# Altium schematic sheet AC_DC_CONTROL.SchDoc
size A4; SheetNumber: 2; SheetTotal: 2
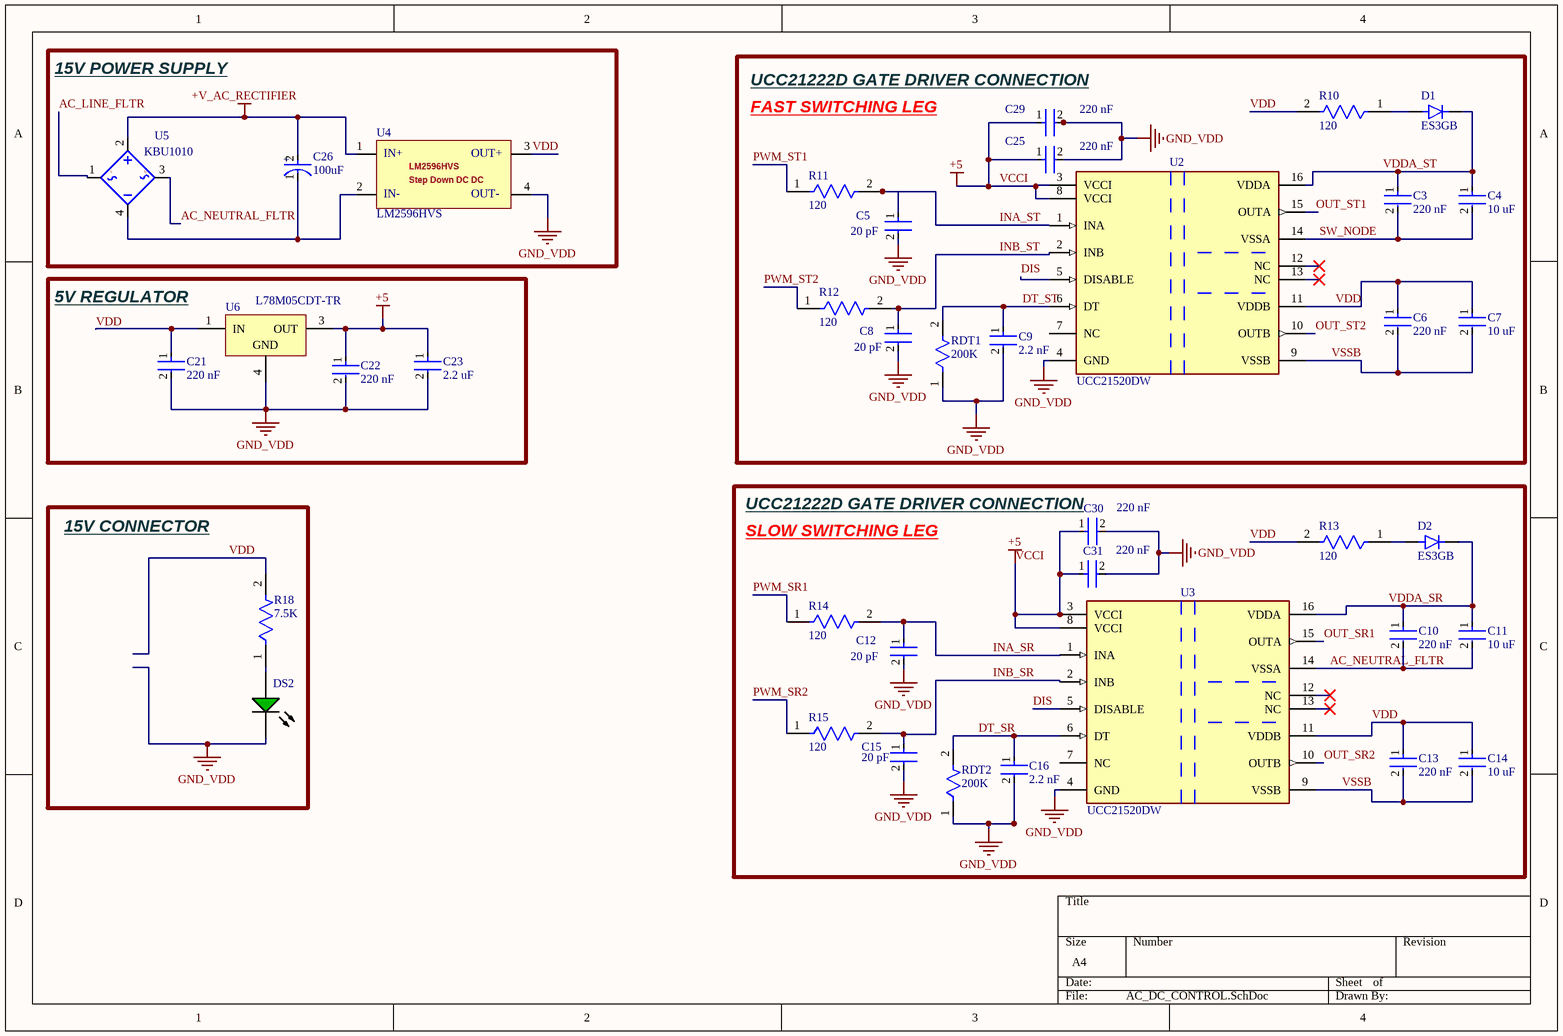
[diagram p0: AC_DC_CONTROL.SchDoc]

## Parts
C3  220 nF  [FP-C0805C-DN-MFG]
C4  10 uF  [FP-C0805C-DN-MFG]
C5  20 pF  [FP-C0805C-DN-MFG]
C6  220 nF  [FP-C0805C-DN-MFG]
C7  10 uF  [FP-C0805C-DN-MFG]
C8  20 pF  [FP-C0805C-DN-MFG]
C9  2.2 nF  [FP-C0805C-DN-MFG]
C10  220 nF  [FP-C0805C-DN-MFG]
C11  10 uF  [FP-C0805C-DN-MFG]
C12  20 pF  [FP-C0805C-DN-MFG]
C13  220 nF  [FP-C0805C-DN-MFG]
C14  10 uF  [FP-C0805C-DN-MFG]
C15  20 pF  [FP-C0805C-DN-MFG]
C16  2.2 nF  [FP-C0805C-DN-MFG]
C21  220 nF  [FP-C0805C-DN-MFG]
C22  220 nF  [FP-C0805C-DN-MFG]
C23  2.2 uF  [FP-C0805C-DN-MFG]
C25  220 nF  [FP-C0805C-DN-MFG]
C26  100uF  [FP-RAD-TH-D_10_0_5-L_30_2-MFG]
C29  220 nF  [FP-C0805C-DN-MFG]
C30  220 nF  [FP-C0805C-DN-MFG]
C31  220 nF  [FP-C0805C-DN-MFG]
D1  ES3GB  [DIOM4336X265N]
D2  ES3GB  [DIOM4336X265N]
DS2  HSMG-C170  [AVAG-HSMX-C170_V]  (value not drawn)
R10  120  [FP-RC0805-0_6-IPC_C]
R11  120  [FP-RC0805-0_6-IPC_C]
R12  120  [FP-RC0805-0_6-IPC_C]
R13  120  [FP-RC0805-0_6-IPC_C]
R14  120  [FP-RC0805-0_6-IPC_C]
R15  120  [FP-RC0805-0_6-IPC_C]
R18  7.5K  [FP-RC0805-0_6-IPC_C]
RDT1  200K  [PCBComponent_1]
RDT2  200K  [PCBComponent_1]
U2  UCC21520DW  [FP-DW0016B-MFG]
U3  UCC21520DW  [FP-DW0016B-MFG]
U4  LM2596HVS  [PCBComponent_1]
U5  KBU1010  [PCBComponent_1]
U6  L78M05CDT-TR  [TO-252_L]

## Blocks framed on the sheet
15V POWER SUPPLY: C26 U4 U5
5V REGULATOR: C21-C23 U6
15V CONNECTOR: DS2 R18

## Nets
+V_AC_RECTIFIER: C26.2(A) U4.1 U5.2
GND_VDD: C5.2 C8.2 C9.2 C12.2 C15.2 C16.2 C21.2 C22.2 C23.2 C25.2 C29.2 C30.2 C31.2 DS2.2(K) RDT1.1 RDT2.1 U2.4(GND) U3.4(GND) U4.4 U6.4(GND)
VCCI: C22.1 C23.1 C25.1 C29.1 C30.1 C31.1 U2.3(VCCI) U2.8(VCCI) U3.3(VCCI) U3.8(VCCI) U6.3(OUT)  [also labelled +5]
AC_LINE_FLTR: U5.1
AC_NEUTRAL_FLTR: C10.2 C11.2 U3.14(VSSA) U5.3
DIS: U2.5(DISABLE) U3.5(DISABLE)
DT_SR: C16.1 RDT2.2 U3.6(DT)
DT_ST: C9.1 RDT1.2 U2.6(DT)
INA_SR: C12.1 R14.2 U3.1(INA)
INA_ST: C5.1 R11.2 U2.1(INA)
INB_SR: C15.1 R15.2 U3.2(INB)
INB_ST: C8.1 R12.2 U2.2(INB)
OUT_SR1: U3.15(OUTA)
OUT_SR2: U3.10(OUTB)
OUT_ST1: U2.15(OUTA)
OUT_ST2: U2.10(OUTB)
PWM_SR1: R14.1
PWM_SR2: R15.1
PWM_ST1: R11.1
PWM_ST2: R12.1
SW_NODE: C3.2 C4.2 U2.14(VSSA)
VDD: C6.1 C7.1 C13.1 C14.1 C21.1 R10.2 R13.2 R18.2 U2.11(VDDB) U3.11(VDDB) U4.3 U6.1(IN)
VDDA_SR: C10.1 C11.1 D2.C(K) U3.16(VDDA)
VDDA_ST: C3.1 C4.1 D1.C(K) U2.16(VDDA)
VSSB: C6.2 C7.2 C13.2 C14.2 U2.9(VSSB) U3.9(VSSB)
NetC26_1: C26.1(C) U4.2 U5.4
NetD1_A: D1.A R10.1
NetD2_A: D2.A R13.1
NetDS2_1: DS2.1(A) R18.1

Not connected (* = marked no-connect by the designer): U2 7(NC) 12(NC)* 13(NC)*; U3 7(NC) 12(NC)* 13(NC)*

## Notes on the sheet
- (near C29) UCC21222D GATE DRIVER CONNECTION
- FAST SWITCHING LEG
- UCC21222D GATE DRIVER CONNECTION
- SLOW SWITCHING LEG
- (in symbol CMP-05427-001313-1) +
- (in symbol KBU1010) L; N
- (in symbol LM2596HVS) IN+; OUT+; Step Down DC DC; IN-; OUT-

## Library data of the parts
C3-C16 C21-C23 C25 C29-C31 = CMP-1036-04552-2: CAP CER 0.22UF 50V X7R 0805; Manufacturer: KEMET; Manufacturer Part Number: C0805C224K5RACTU; Value: 0.22 μF; Temperature Coefficient: 30ppm/°C; Material: Ceramic; Tolerance: 0.1; ComponentLink2URL: https://content.kemet.com/datasheets/KEM_C1003_C0G_SMD.pdf; Temperature Characteristic: X7R; Device Class L3: Ceramic Capacitors; Lead Free: Yes; Temperature: -55°C to +125°C; RoHS: TRUE; Capacitance: 0.22 μF; Automotive: No; Octopart: https://octopart.com/c0805c224k5ractu-kemet-144670; Temperature Range Low: -55°C; Height: 0.88mm; Device Class L1: Passive Components; Digikey Description: CAP CER 0.22UF 50V X7R 0805; ComponentLink2Description: Datasheet; Mouser Description: CAP CER 0.22UF 50V X7R 0805; Category: Cap; Ipc Land Pattern Name: CAPC200125X78; Temperature Range High: +125°C; Package: C0805C-DN; Device Class L2: Capacitors; Voltage Rating: 50 V
C26 = CMP-05427-001313-1: Aluminum Electrolytic Capacitors (Radial Lead Type) AEC-Q200 Qualified 100uF ±20% 100V; Dissipation Factor: 0.07%; Ripple Current (AC): 698mA; Leakage Current: 3uA; Impedance: 150mR; Lead Diameter: 0.6mm; Polarity: Polar; Life (Hours): 3000Hour; Series: FC; Lead Pitch: 5mm; Height: 30mm; Size: 30mm; Contact Plating: Tin; Case/Package: Radial; Mount: Through Hole; Ratings: AEC-Q200; Tolerance: 20%; REACH SVHC: No SVHC; Termination: Radial; Voltage Rating (DC): 100V; Diameter: 10mm; Construction: RADIAL; Min Operating Temperature: -55°C; Capacitance: 100uF; Packaging: Bulk; Voltage Rating: 100V; Voltage: 100V; Height - Seated (Max): 1.181inch; Ripple Current: 698mA; Lead Free: Lead Free; Length: 30mm; Package Quantity: 100; Max Operating Temperature: 105°C; Number of Pins: 2; ESR (Equivalent Series Resistance): 150mR; Radiation Hardening: No; RoHS Compliant: Yes
D1 D2 = ES3GB: MF: {'manufacturer': u'Taiwan Semiconductor'}; Package: None; Price: None; Value: *; MP: ES3GB; Availability: Unavailable
DS2 = CMP-2000-05062-1: Chip LED, Green, 2.2 V, -40 to 85 degC, 2-Pin SMD, Pb-Free, Tape and Reel; Manufacturer: Avago; No. of Pins: 2; Peak Wavelength: 570nm; SVHC: NoSVHC(16-Jun-2014); Dominant Wavelength: 572nm; Forward Current If: 20mA; Viewing Angle: 170deg; Lens Shape: Rectangular; PIV Max: 5V; External Width: 1.25mm; LED Type: Standard; External Depth: 0.8mm; Opto Mounting Orientation: Top; Luminous Intensity: 15mcd; Luminous Intensity Min: 4mcd; Forward Voltage VF Max: 2.6V; External Length / Height: 2mm; Bulb Size: 1.25mmx1.4mm; Light Area Height: 1mm; Voltage Vf Typ: 2.2V; Operating Temperature Max: 85degC; Datasheet Version: Oct-08; MSL: MSL2A-4weeks; Peak Forward Current: 20mA; Package Description: 2-Pin Surface Mount Device, Body 2 x 1.25 mm, Height 0.8 mm; Datasheet URL: https://datasheet.ciiva.com/29280/180495-da-01-en-chip-led-hsmg-c170-gelb-gruen-29280971.pdf; Storage Temperature Min: -40degC; LED Colour: Green; Wavelength Typ: 570nm; Mounting Type: SMD; Forward Current If Max: 20mA; Dominant Wavelength Typ: 572nm; LED Mounting: SMD; Operating Temperature Range: -30degCto+85degC; Operating Temperature Min: -30degC; Manufacturer URL: http://www.avagotech.com/; Packaging: CutTape; Luminous Intensity Typ: 15mcd; Package Reference: HSMX-C170; Storage Temperature Max: 85degC; Opto Case Style: SMD; Forward Voltage: 2.2V
R10-R15 R18 = CMP-2100-03668-5: RES 100K OHM 1% 1/8W 0805; Power Rating: 125mW; Temperature Coefficient: 100ppm/°C; Voltage Rating (DC): 150V; Resistance: 100kR; Package Quantity: 1; Case/Package: 0805; Lead Pitch: 0.4mm; Case Code (Imperial): 0805; Construction: Rectangular; Number of Terminations: 2; RoHS Compliant: Yes; Max Power Dissipation: 125mW; Tolerance: 1%; Max Operating Temperature: 155°C; Resistance Tolerance: 1%; Lead Free: Lead Free; Packaging: Tape and Reel; Resistor Type: Thick Film; Min Operating Temperature: -55°C; Case Code (Metric): 2012; Series: RC; Technology: THICK FILM; Voltage Rating: 150V; Termination: SMD/SMT; Width: 0.049inch; Number of Pins: 2; Features: Moisture Resistant; Military Standard: Not; Length: 0.079inch; Depth: 1.25mm; Size Code: 0805; Height: 0.024inch
RDT1 RDT2 = RES
U2 U3 = CMP-04912-000047-1: DGTL ISO 5.7KV GATE DRVR 16SOIC; Number of Channels: 2; Max Output Current: 6A; Min Supply Voltage: 6.5V; Working Voltage: 2.121kV; Max Supply Voltage: 25V; Max Operating Temperature: 125°C; REACH SVHC: No SVHC; Case/Package: SOIC; Min Operating Temperature: -40°C; Number of Pins: 16; Lead Free: Lead Free
U6 = CMP-0244-00178-1: Positive Voltage Regulator, 5V, 3-Pin DPAK, Tape and Reel; PackageReference: TO-252; ComponentLink1URL: http://www.st.com; ComponentLink2Description: Datasheet; PackageDescription: 3-Pin Transistor Outline Package 2.28 mm Pitch, 9.7 mm Lead Span (DPAK); ComponentLink1Description: Manufacturer URL; DatasheetVersion: 1/11/2010; ComponentLink2URL: http://www.st.com/internet/com/TECHNICAL_RESOURCES/TECHNICAL_LITERATURE/DATASHEET/CD00000447.pdf; PackageVersion: 2011